# Altium schematic sheet MelansonTech PSU_IsolatedShuntAmp.SchDoc
size B
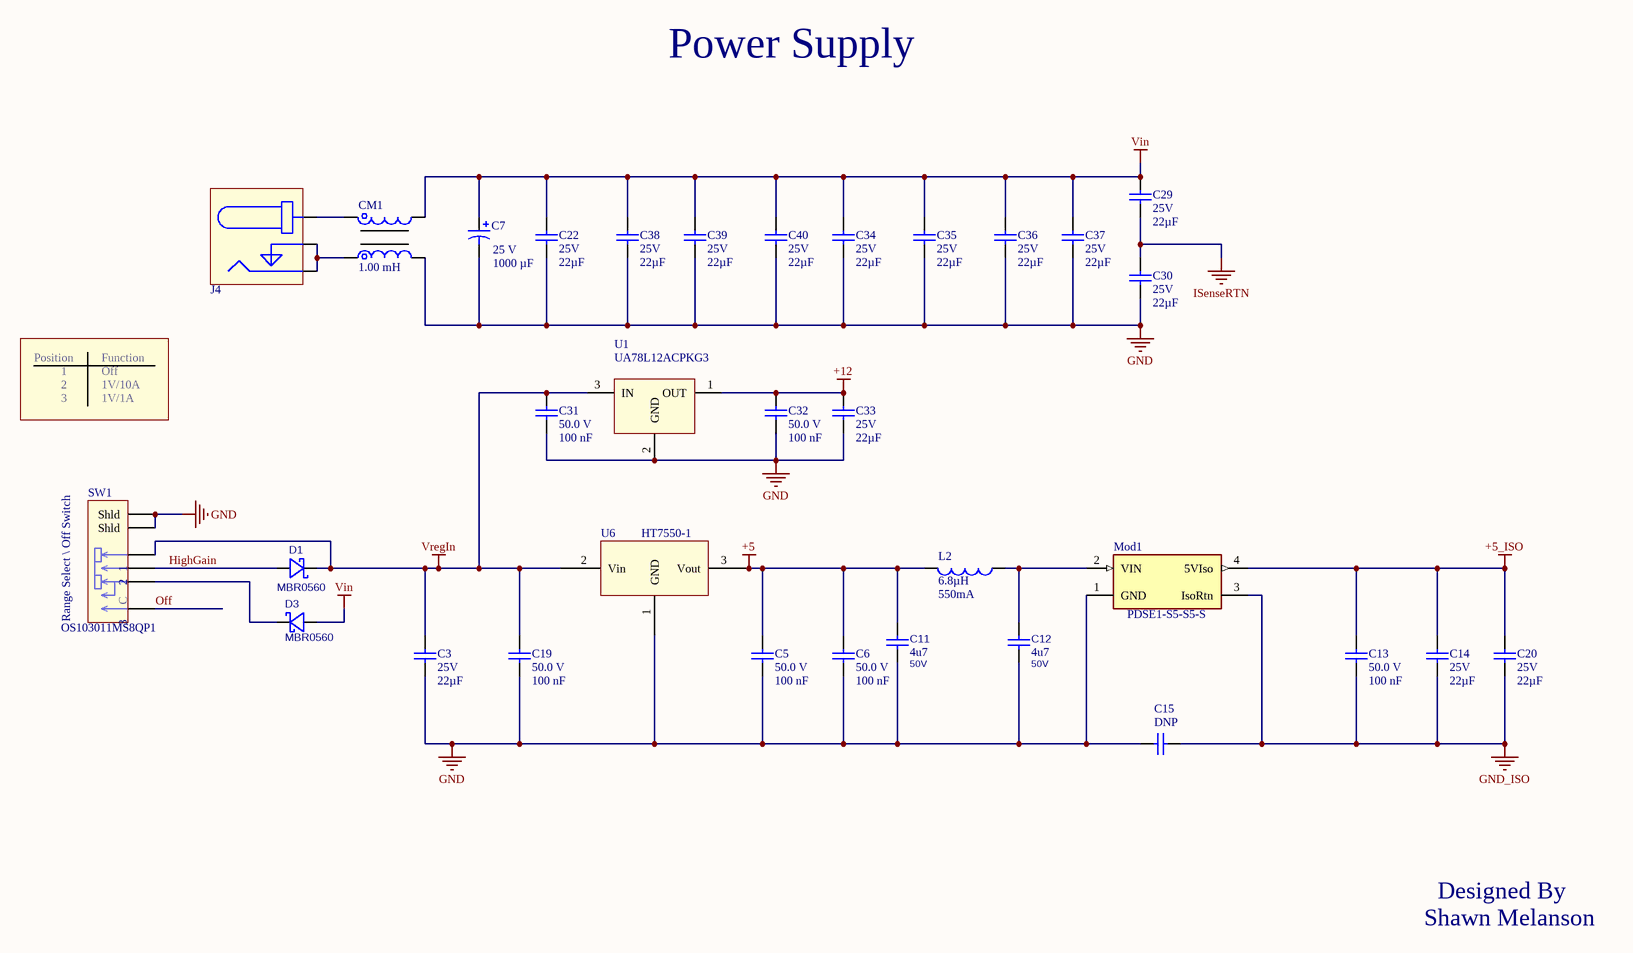
[diagram p0: MelansonTech PSU_IsolatedShuntAmp.SchDoc]

## Parts
C3  Voltage - Rated: 25V  Capacitance: 22µF  [Cap,0805]  (hidden comment: CL21A226MAQNNNE)
C5  Voltage Rating (DC): 50.0 V  Capacitance: 100 nF  [CAP, 0805, HD]  (hidden comment: CC0805KRX7R9BB104)
C6  Voltage Rating (DC): 50.0 V  Capacitance: 100 nF  [CAP, 0805, HD]  (hidden comment: CC0805KRX7R9BB104)
C7  Capacitance: 1000 µF  Voltage - Rated: 25 V  [Cap,5mm Lead Spaceing,14mm HIGH,10MM Dia, Polymer - RA1]  (hidden comment: A750MV108M1EAAE014)
C11  Capacitance: 4u7  Voltage: 50V  [Cap, 1206]  (hidden comment: CL31B475KBHNNNE)
C12  Capacitance: 4u7  Voltage: 50V  [Cap, 1206]  (hidden comment: CL31B475KBHNNNE)
C13  Voltage Rating (DC): 50.0 V  Capacitance: 100 nF  [Cap,0805]  (hidden comment: CC0805KRX7R9BB104)
C14  Voltage - Rated: 25V  Capacitance: 22µF  [Cap,0805]  (hidden comment: CL21A226MAQNNNE)
C15  S102K33Y5PP63K5R  [Cap, 5mm Lead Spaceing, 4mm dai]  (value not drawn)
C19  Voltage Rating (DC): 50.0 V  Capacitance: 100 nF  [CAP, 0805, HD]  (hidden comment: CC0805KRX7R9BB104)
C20  Voltage - Rated: 25V  Capacitance: 22µF  [Cap,0805]  (hidden comment: CL21A226MAQNNNE)
C22  Voltage - Rated: 25V  Capacitance: 22µF  [Cap,0805]  (hidden comment: CL21A226MAQNNNE)
C29  Voltage - Rated: 25V  Capacitance: 22µF  [Cap,0805]  (hidden comment: CL21A226MAQNNNE)
C30  Voltage - Rated: 25V  Capacitance: 22µF  [Cap,0805]  (hidden comment: CL21A226MAQNNNE)
C31  Voltage Rating (DC): 50.0 V  Capacitance: 100 nF  [CAP, 0805, HD]  (hidden comment: CC0805KRX7R9BB104)
C32  Voltage Rating (DC): 50.0 V  Capacitance: 100 nF  [CAP, 0805, HD]  (hidden comment: CC0805KRX7R9BB104)
C33  Voltage - Rated: 25V  Capacitance: 22µF  [Cap,0805]  (hidden comment: CL21A226MAQNNNE)
C34  Voltage - Rated: 25V  Capacitance: 22µF  [Cap,0805]  (hidden comment: CL21A226MAQNNNE)
C35  Voltage - Rated: 25V  Capacitance: 22µF  [Cap,0805]  (hidden comment: CL21A226MAQNNNE)
C36  Voltage - Rated: 25V  Capacitance: 22µF  [Cap,0805]  (hidden comment: CL21A226MAQNNNE)
C37  Voltage - Rated: 25V  Capacitance: 22µF  [Cap,0805]  (hidden comment: CL21A226MAQNNNE)
C38  Voltage - Rated: 25V  Capacitance: 22µF  [Cap,0805]  (hidden comment: CL21A226MAQNNNE)
C39  Voltage - Rated: 25V  Capacitance: 22µF  [Cap,0805]  (hidden comment: CL21A226MAQNNNE)
C40  Voltage - Rated: 25V  Capacitance: 22µF  [Cap,0805]  (hidden comment: CL21A226MAQNNNE)
CM1  Inductance: 1.00 mH  [CM Choke,SMD, DR331]  (hidden comment: DR331-105BE)
D1  MBR0560  [SOD123]
D3  MBR0560  [SOD123]
J4  PJ-002A  [Connector,Barrel,2.1mm,5.5mm,DC power Jack]  (value not drawn)
L2  Inductance: 6.8µH  Current Rating (Amps): 550mA  [Ind, 0805]  (hidden comment: MLZ2012N6R8LT000)
Mod1  PDSE1-S5-S5-S  [CONV_PDSE1-S5-S5-S]
SW1  OS103011MS8QP1  [Switch,Slide,.SP3T, OS103011 -Side]
U1  UA78L12ACPKG3  [SOT89-3]
U6  HT7550-1  [SOT89-3]

## Nets
+5: C5.2 C6.2 C11.2 L2.2 U6.3(Vout)
+5_ISO: C13.2 C14.2 C20.2 Mod1.4(5VIso)
+12: C32.2 C33.2 U1.1(OUT)
GND: C3.1 C5.1 C6.1 C7.2 C11.1 C12.1 C15.2 C19.1 C22.1 C30.1 C31.1 C32.1 C33.1 C34.1 C35.1 C36.1 C37.1 C38.1 C39.1 C40.1 CM1.4 Mod1.1(GND) SW1.5(Shld) SW1.6(Shld) U1.2(GND) U6.1(GND)
GND_ISO: C13.1 C14.1 C15.1 C20.1 Mod1.3(IsoRtn)
ISenseRTN: C29.1 C30.2
Vin: C7.1 C22.2 C29.2 C34.2 C35.2 C36.2 C37.2 C38.2 C39.2 C40.2 CM1.2 D3.2(A)
VregIn: C3.2 C19.2 C31.2 D1.1(C) SW1.4 U1.3(IN) U6.2(Vin)
HighGain: D1.2(A) SW1.3
Off: SW1.1
NetC12_2: C12.2 L2.1 Mod1.2(VIN)
NetCM1_1: CM1.1 J4.1
NetCM1_3: CM1.3 J4.2 J4.3
NetD3_1: D3.1(C) SW1.2

## Notes on the sheet
- Power Supply
- Position
- 1
- 2
- Function
- Off
- 1V/10A
- 3
- 1V/1A
- Range Select \ Off Switch
- (near C15) DNP
- Shawn Melanson
- Designed By
- (in symbol Switch,TH,Slide,SP3T,100MA,12V,OS103011MS8QP1) C

## Library data of the parts
C3 C14 C20 C22 C29 C30 C33-C40 = Cap,0805,22uF,25V,X5R,±20%,CL21A226MAQNNNE: CAP CER 22UF 25V X5R 0805; Manufacturer: Samsung Electro-Mechanics; Detailed Description: 22 µF ±20% 6.3V Ceramic Capacitor X5R 0805 (2012 Metric); Tolerance: ±20%; mfg P/N: CL21A226MAQNNNE; Category: Capacitors  Ceramic Capacitors; Series: CL; Part Status: Active; Temperature Coefficient: X5R; Operating Temperature: -55°C ~ 85°C; Applications: General Purpose; Mounting Type: Surface Mount, MLCC; Package / Case: 0805 (2012 Metric); Size / Dimension: 0.079" L x 0.049" W (2.00mm x 1.25mm); Thickness (Max): 0.055" (1.40mm); Supplier 1: Mouser; Supplier Part Number 1: 187-CL31B226KPHNNNE; Supplier 2: Digikey; Supplier Part Number 2: 1276-2769-6-ND; Supplier 3: Digikey; Supplier Part Number 3: 1276-2769-1-ND
C5 C6 C13 C19 C31 C32 = Cap,0805,100nf,50V,5%,CC0805KRX7R9BB104: CAP CER 0.1UF 50V X7R 0805; Manufacturer: YAGEO; Capacitance Tolerance: ±10%; Detailed Description: 0.1 µF ±10% 50V Ceramic Capacitor X7R 0805 (2012 Metric); Supplier 1: Digikey; Supplier Part Number 1: 311-1140-6-ND; Supplier 2: Digikey; Supplier Part Number 2: 311-1140-1-ND; Supplier 3: Mouser; Supplier Part Number 3: 603-CC805KRX7R9BB104; Supplier 4: Arrow Electronics; Supplier Part Number 4: CC0805KRX7R9BB104; Supplier 5: Digikey; Supplier Part Number 5: 311-1140-2-ND; Supplier 6: Future Electronics; Supplier Part Number 6: 2986263; Manufacturer Product Number: CC0805KRX7R9BB104; Category: Capacitors  Ceramic Capacitors; Series: CC; Part Status: Active; Temperature Coefficient: X7R; Operating Temperature: -55°C ~ 125°C; Applications: General Purpose; Mounting Type: Surface Mount, MLCC; Package / Case: 0805 (2012 Metric); Size / Dimension: 0.079" L x 0.049" W (2.00mm x 1.25mm); Thickness (Max): 0.033" (0.85mm)
C7 = Cap,Polar,TH,1000uF,25V,Polymer,±20%,A750MV108M1EAAE014: 1000 µF 25 V Aluminum - Polymer Capacitors Radial, Can 14mOhm 2000 Hrs @ 105°C; Manufacturer: KEMET; Tolerance: ±20%; Ripple Current @ Low Frequency: 255 mA @ 120 Hz; Ripple Current @ High Frequency: 5.1 A @ 100 kHz; Base Product Number: A750MV; mfg P/N: A750MV108M1EAAE014; Detailed Description: 1000 µF 25 V Aluminum - Polymer Capacitors Radial, Can 14mOhm 2000 Hrs @ 105°C; Category: Capacitors  Aluminum - Polymer Capacitors; Series: A750; Part Status: Active; Type: Polymer; ESR (Equivalent Series Resistance): 14mOhm; Lifetime @ Temp.: 2000 Hrs @ 105°C; Operating Temperature: -55°C ~ 105°C; Applications: General Purpose; Lead Spacing: 0.197" (5.00mm); Size / Dimension: 0.394" Dia (10.00mm); Height - Seated (Max): 0.630" (16.00mm); Mounting Type: Through Hole; Package / Case: Radial, Can; Supplier 1: Digi-Key; Supplier Part Number 1: 399-A750MV108M1EAAE014-ND; Supplier 2: Mouser; Supplier Part Number 2: 80-A750MV108M1EAAE14
C11 C12 = Cap,1206,4.7uF,10%,50V,CL31B475KBHNNNE: Cap,SMD,MLCC,4u7,50V,X7R,10%,1206; Manufacturer: Samsung; Manufacturer P/N: CL31B475KBHNNNE; Tolerance: 10%; Package: 1206; Supplier 1: LCSC; Supplier Part Number 1: C51205; Supplier 2: Digi-Key; Supplier Part Number 2: 1276-2789-1-ND
C15 = Cap,TH,Ceramic,5mm Spacing,1nF,2kV, S102K33Y5PP63K5R: CAP CER 1000PF 2KV Y5P RADIAL; Manufacturer: Vishay BC Components; Detailed Description: 1000pF ±10% 2000V (2kV) Ceramic Capacitor Y5P (B) Radial, Disc; Tolerance: ±10%; Temperature Coefficient: Y5P (B); Voltage - Rated: 2000V (2kV); Capacitance: 1nF; mfg P/N: S102K33Y5PP63K5R; Category: Capacitors  Ceramic Capacitors; Series: S; Part Status: Active; Operating Temperature: -30°C ~ 125°C; Applications: General Purpose; Mounting Type: Through Hole; Package / Case: Radial, Disc; Size / Dimension: 0.335"" Dia (8.50mm); Height - Seated (Max): 0.492"" (12.50mm); Lead Spacing: 0.197"" (5.00mm); Lead Style: Formed Leads - Kinked
CM1 = common mode, 1mH@100kHz, 500mA, SMD,2ln, DR331-105BE: CMC 1MH 500MA 2LN SMD; Lead-Free Status: Lead Free; Detailed Description: 1 mH @ 100 kHz 2 Line Common Mode Choke Surface Mount 500mA DCR 400mOhm; Category  Filters: Common Mode Chokes; Filter Type: Signal Line; Number of Lines: 2; DC Resistance (DCR) (Max): 400mOhm; Voltage Rating - DC: 80V; Voltage Rating - AC: 42V; Base Product Number: DR331; mfg P/N: DR331-105BE; Mounting Style: SMD; Current Rating: 500mA; Series: DR331; Part Status: Active; Inductance @ Frequency: 1 mH @ 100 kHz; Operating Temperature: -40°C ~ 135°C; Mounting Type: Surface Mount; Size / Dimension: 0.287" L x 0.213" W (7.30mm x 5.40mm); Height (Max): 0.197" (5.00mm); Package / Case: Horizontal, 4 Flat Lead
D1 D3 = Diode,SOD123,Shottky,60V,0.5A,MBR0560: Dio,Sig,Schtky,0.5A,60V,SOD123; Manufacturer: MCC; mfg P/N: MBR0560-TP; Details: 700mV @ 500mA, 200µA @ 60V,30pF @ 4V, 1MHz; Not Stuffed: N/S; Fast Supplier: Digi-Key; Current: 0.5A; Package: SOD123; Voltage: 60V; Supplier 1: Digi-Key; Supplier Part Number 1: MBR0560TPMSCT-ND; Supplier 2: LCSC; Supplier Part Number 2: C150515
J4 = Connector,Barrel,ID 2.1mm,OD 5.5mm,Power Connect, PJ-002A: Power Barrel Connector Jack 2.10mm ID (0.083"), 5.50mm OD (0.217") Through Hole, Right Angle; Manufacturer: CUI Inc.; Actual Diameter: 0.079" (2.00mm ID), 0.256" (6.50mm OD); Number of Positions/Contacts: 2 Conductors, 3 Contacts; Mating Length/Depth: 0.354" (9.00mm); Dielectric Material: Polybutylene Terephthalate (PBT); Internal Switch(s): Does Not Contain Switch; Shielding: Unshielded; Voltage - Rated: 24VDC; Current Rating (Amps): 2.5A; Material Flammability Rating: UL94 V-0; Body Color: Black; mfg P\N: PJ-002A; Industry Recognized Mating Diameter: 2.10mm ID (0.083"), 5.50mm OD (0.217"); Connector Type: Jack; Mounting Type: Through Hole, Right Angle; Termination: Solder Eyelet(s); Contact Material - Plating: Tin; Operating Temperature: -25°C ~ 85°C; Contact Material: Brass, Copper Alloy; Supplier 1: Digi-Key; Supplier Part Number 1: CP-002A-ND
L2 = Ind,0805,6.8uH,550mA,0.25Ω, MLZ2012N6R8LT000: FIXED IND 6.8UH 550MA 250 MOHM; Manufacturer: TDK Corporation; Detailed Description: 6.8µH Shielded Multilayer Inductor 550mA 250mOhm 0805 (2012 Metric); Type: Multilayer; Material - Core: Ferrite; Tolerance: ±20%; Current - Saturation: 110mA; Shielding: Shielded; Frequency - Self Resonant: 60MHz; Inductance Frequency - Test: 2MHz; mfg P/N: MLZ2012N6R8LT000; Category: Inductors, Coils, Chokes  Fixed Inductors; Series: MLZ; Part Status: Active; DC Resistance (DCR): 250mOhm; Operating Temperature: -55°C ~ 125°C; Mounting Type: Surface Mount; Package / Case: 0805 (2012 Metric); Supplier Device Package: 0805 (2012 Metric); Size / Dimension: 0.079"" L x 0.049"" W (2.00mm x 1.25mm); Height - Seated (Max): 0.041"" (1.05mm); Supplier 1: Digi-Key; Supplier Part Number 1: 445-6761-1-ND; Supplier 2: LCSC; Supplier Part Number 2: C82157
Mod1 = Mod,PSU,4.5-5.5Vin,5Vout,1W, PDSE1-S5-S5-S: DC-DC ISOLATED, 1 W, 4.5-5.5 VDC; Manufacturer: CUI Inc.; Detailed Description: Isolated Module DC DC Converter 1 Output 5V    200mA 4.5V - 5.5V Input; Voltage - Isolation: 3kV; Voltage - Input (Min): 4.5V; Voltage - Input (Max): 5.5V; Voltage - Output 1: 5V; Current - Output (Max): 200mA; Efficiency: 82%; Approval Agency: CE, cURus; Number of Outputs: 1; Power (Watts): 1W; mfg P/N: PDSE1-S5-S5-S; Series: PDSE1-S (1W); Category: Power Supplies - Board Mount  DC DC Converters; Part Status: Active; Type: Isolated Module; Applications: ITE (Commercial); Features: SCP; Operating Temperature: -40°C ~ 105°C (With Derating); Mounting Type: Through Hole; Package / Case: 4-SIP Module; Size / Dimension: 0.46"" L x 0.24"" W x 0.40"" H (11.6mm x 6.0mm x 10.2mm); Supplier 1: Digi-Key; Supplier Part Number 1: 102-6291-ND
SW1 = Switch,TH,Slide,SP3T,100MA,12V,OS103011MS8QP1: SWITCH SLIDE SP3T 100MA 12V; Manufacturer: C&K; Detailed Description: Slide Switch SP3T Through Hole; Switch Function: On-On-On; Current Rating (Amps): 100mA (DC); Actuator Type: Standard; Actuator Length: 4.00mm; Actuator Material: Polyoxymethylene (Acetal) (POM); Switch Travel: 2.00mm; Mechanical Life: 10,000 Cycles; mfg P/N: OS103011MS8QP1; Part Status: Active; Circuit: SP3T; Voltage Rating - DC: 12V; Contact Material: Copper Alloy; Contact Finish: Silver; Mounting Type: Through Hole; Termination Style: PC Pin; Features: Epoxy Sealed Terminals; Operating Temperature: -30°C ~ 70°C; Electrical Life: 10,000 Cycles; Supplier 1: Digi-Key; Supplier Part Number 1: CKN9543-ND; Supplier 2: LCSC; Supplier Part Number 2: C221831
U1 = Reg,Linear,Pos,Fixed,12Vout,27Vin,100mA,UA78L12ACPKG3: IC REG LINEAR 12V 100MA SOT89-3; Manufacturer: Texas Instruments; Detailed Description: Linear Voltage Regulator IC Positive Fixed 1 Output 100mA SOT-89-3; Output Configuration: Positive; Output Type: Fixed; Voltage - Input (Max): 27V; Voltage Dropout (Max): 1.7V @ 40mA; PSRR: 42dB (120Hz); Protection Features: Over Current, Over Temperature, Reverse Polarity, Short Circuit; Number of Regulators: 1; mfg P/N: UA78L12ACPKG3; Category: Integrated Circuits (ICs)  PMIC - Voltage Regulators - Linear; Part Status: Active; Voltage - Output (Min/Fixed): 12V; Current - Output: 100mA; Operating Temperature: 0°C ~ 125°C; Mounting Type: Surface Mount; Package / Case: TO-243AA; Supplier Device Package: SOT-89-3; Base Product Number: UA78L12; Supplier 1: Digi-Key; Supplier Part Number 1: 296-50454-6-ND; Supplier 2: Mouser; Supplier Part Number 2: 595-UA78L12ACPKG3; Supplier 3: Arrow Electronics; Supplier Part Number 3: UA78L12ACPKG3
U6 = Reg,Linear,Fixed,SOT-89-3,30Vin,5Vout,150mA,HT7550-1: LOW DROPOUT REGULATORS(LDO) POSITIVE FIXED 55MV @ 1MA 30V 5V 150MA SOT-89(SOT-89-3) ROHS; Manufacturer: Holtek Semicon; Input Voltage (Max): 30Vdc; Output voltage accuracy: tolerance ±3%; Quiescent current: 2.5μA; Output Voltage: 5Vdc; LCSC Part #: C16106; Package: SOT-89-3; Output Current (Max): 150mA; mfg P/N: HT7550-1